# EAGLE design msp432_breakout_uart (EAGLE 7.5.0)
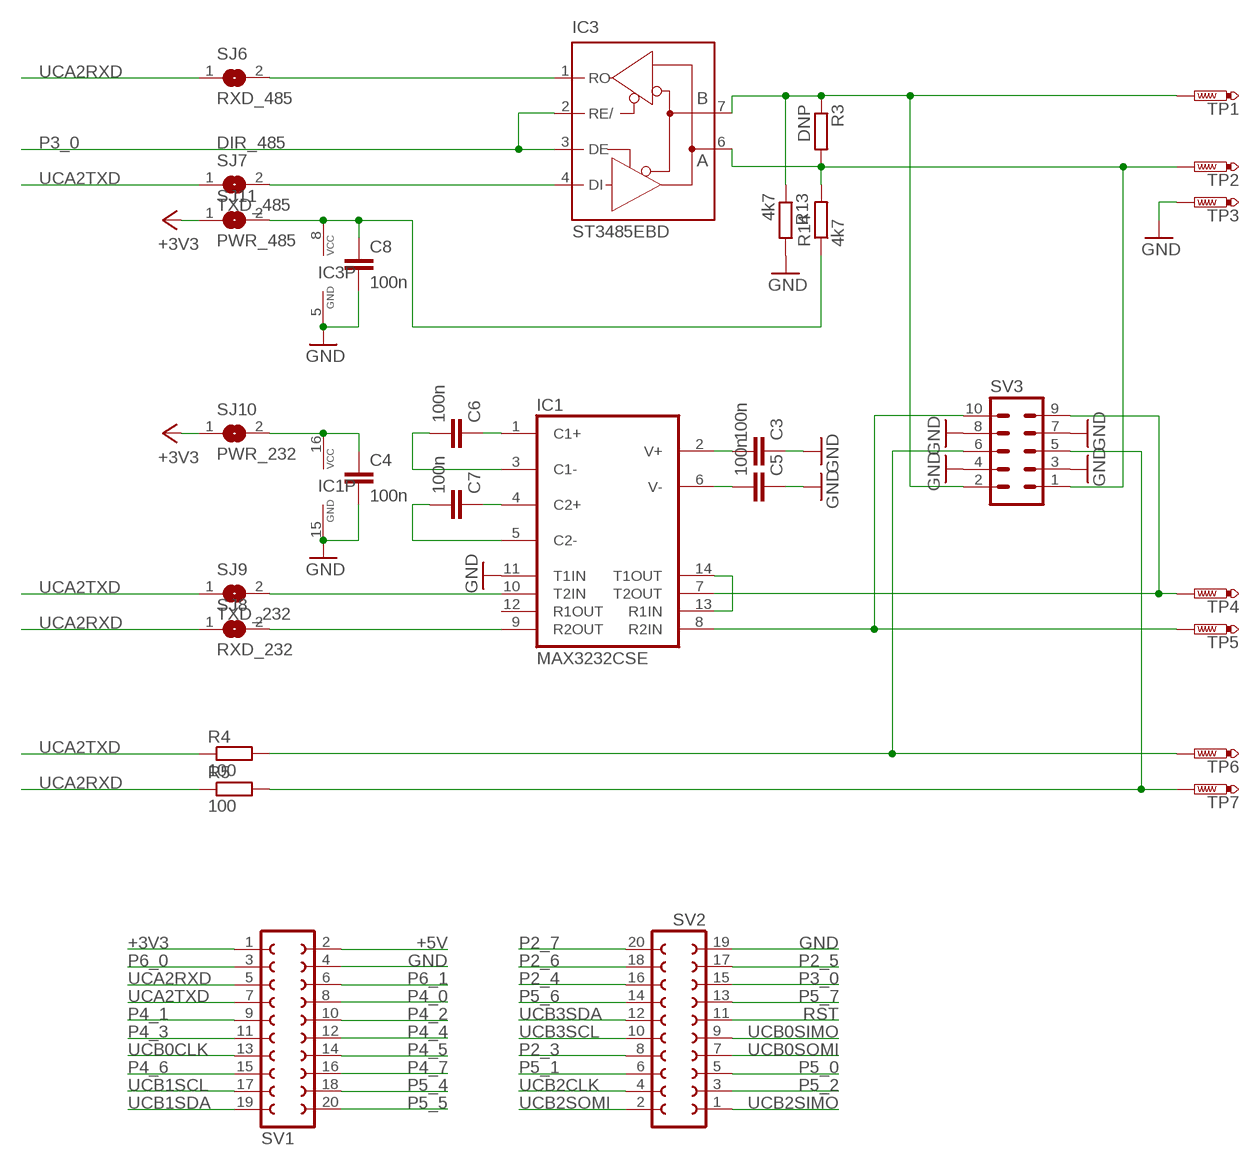
[diagram p0: schematic, sheet 1]

## Parts
C3  100n  C-EUC0603  [C0603]
C4  100n  C-EUC0603  [C0603]
C5  100n  C-EUC0603  [C0603]
C6  100n  C-EUC0603  [C0603]
C7  100n  C-EUC0603  [C0603]
C8  100n  C-EUC0603  [C0603]
IC1  MAX3232CSE  [SO16]
IC3  ST3485EBD  MAX481CSA  [SO08]
R3  DNP  R-EU_R0603  [R0603]
R4  100  R-EU_R0603  [R0603]
R5  100  R-EU_R0603  [R0603]
R13  4k7  R-EU_R0603  [R0603]
R14  4k7  R-EU_R0603  [R0603]
SJ6  RXD_485  SJ  [SJ]
SJ7  TXD_485  SJ  [SJ]
SJ8  RXD_232  SJ  [SJ]
SJ9  TXD_232  SJ  [SJ]
SJ10  PWR_232  SJ  [SJ]
SJ11  PWR_485  SJ  [SJ]
SV1  FE10-2  [FE10-2]
SV2  FE10-2  [FE10-2]
SV3  ML10  [ML10]
TP1  PTR1PAD1-20  [P1-20]
TP2  PTR1PAD1-20  [P1-20]
TP3  PTR1PAD1-20  [P1-20]
TP4  PTR1PAD1-20  [P1-20]
TP5  PTR1PAD1-20  [P1-20]
TP6  PTR1PAD1-20  [P1-20]
TP7  PTR1PAD1-20  [P1-20]

## Nets
+3V3: SJ10.1 SJ11.1 SV1.1
+5V: SV1.2
CA: IC3.6(A) R3.2 R14.2 SV3.1 TP2.TP
CB: IC3.7(B) R3.1 R13.1 SV3.2 TP1.TP
GND [power]: C3.1 C4.2 C5.1 C8.2 IC1.11(T1IN) IC1.15(GND) IC3.5(GND) R13.2 SV1.4 SV2.19 SV3.3 SV3.4 SV3.7 SV3.8 TP3.TP
N$1: IC1.8(R2IN) SV3.10 TP5.TP
N$2: R5.2 SV3.5 TP7.TP
N$4: R4.2 SV3.6 TP6.TP
N$6: IC1.7(T2OUT) SV3.9 TP4.TP
N$8: C5.2 IC1.6(V-)
N$9: C3.2 IC1.2(V+)
N$10: C6.1 IC1.1(C1+)
N$11: C6.2 IC1.3(C1-)
N$12: C7.1 IC1.4(C2+)
N$13: C7.2 IC1.5(C2-)
N$14: IC1.13(R1IN) IC1.14(T1OUT)
N$15: IC1.10(T2IN) SJ9.2
N$16: IC1.9(R2OUT) SJ8.2
N$17: IC3.1(RO) SJ6.2
N$18: IC3.4(DI) SJ7.2
N$19: C4.1 IC1.16(VCC) SJ10.2
N$20: C8.1 IC3.8(VCC) R14.1 SJ11.2
P2_3: SV2.8
P2_4: SV2.16
P2_5: SV2.17
P2_6: SV2.18
P2_7: SV2.20
P3_0: IC3.2(RE/) IC3.3(DE) SV2.15
P4_0: SV1.8
P4_1: SV1.9
P4_2: SV1.10
P4_3: SV1.11
P4_4: SV1.12
P4_5: SV1.14
P4_6: SV1.15
P4_7: SV1.16
P5_0: SV2.5
P5_1: SV2.6
P5_2: SV2.3
P5_4: SV1.18
P5_5: SV1.20
P5_6: SV2.14
P5_7: SV2.13
P6_0: SV1.3
P6_1: SV1.6
RST: SV2.11
UCA2RXD: R5.1 SJ6.1 SJ8.1 SV1.5
UCA2TXD: R4.1 SJ7.1 SJ9.1 SV1.7
UCB0CLK: SV1.13
UCB0SIMO: SV2.9
UCB0SOMI: SV2.7
UCB1SCL: SV1.17
UCB1SDA: SV1.19
UCB2CLK: SV2.4
UCB2SIMO: SV2.1
UCB2SOMI: SV2.2
UCB3SCL: SV2.10
UCB3SDA: SV2.12
Unconnected: IC1.12(R1OUT)

## Notes on the sheet
- DIR_485

## Library data of the parts
C3-C8 = rcl:C-EU: CAPACITOR, European symbol
IC1 = maxim:MAX3232*: True RS-232 Transceivers 3.0V to 5.5V, Low-Power up to 1Mbps, Using Four 0.1µF External Capacitors Source: http://pdfserv.maxim-ic.com/en/ds/MAX3222-MAX3241.pdf; MPN: MAX3232CSE; OC_FARNELL: 9725490; OC_NEWARK: 90C2890
IC3 = maxim:MAX481CSA: RS485 TRANSEIVER; MF: MAXIM; MPN: MAX481CSA; OC_FARNELL: unknown; OC_NEWARK: 90C3817
R3-R5 R13 R14 = rcl:R-EU_: RESISTOR, European symbol
SJ6-SJ11 = jumper:SJ: SMD solder JUMPER
SV1 SV2 = con-lsta:FE10-2: FEMALE HEADER; OC_FARNELL: unknown; OC_NEWARK: unknown
SV3 = con-harting-ml:ML10: HARTING; OC_FARNELL: unknown; OC_NEWARK: unknown
TP1-TP7 = testpad:PTR1: TEST PIN

## Net classes
1 power: width 0.254 mm, drill 0.33 mm, clearance 0.152 mm

## Board
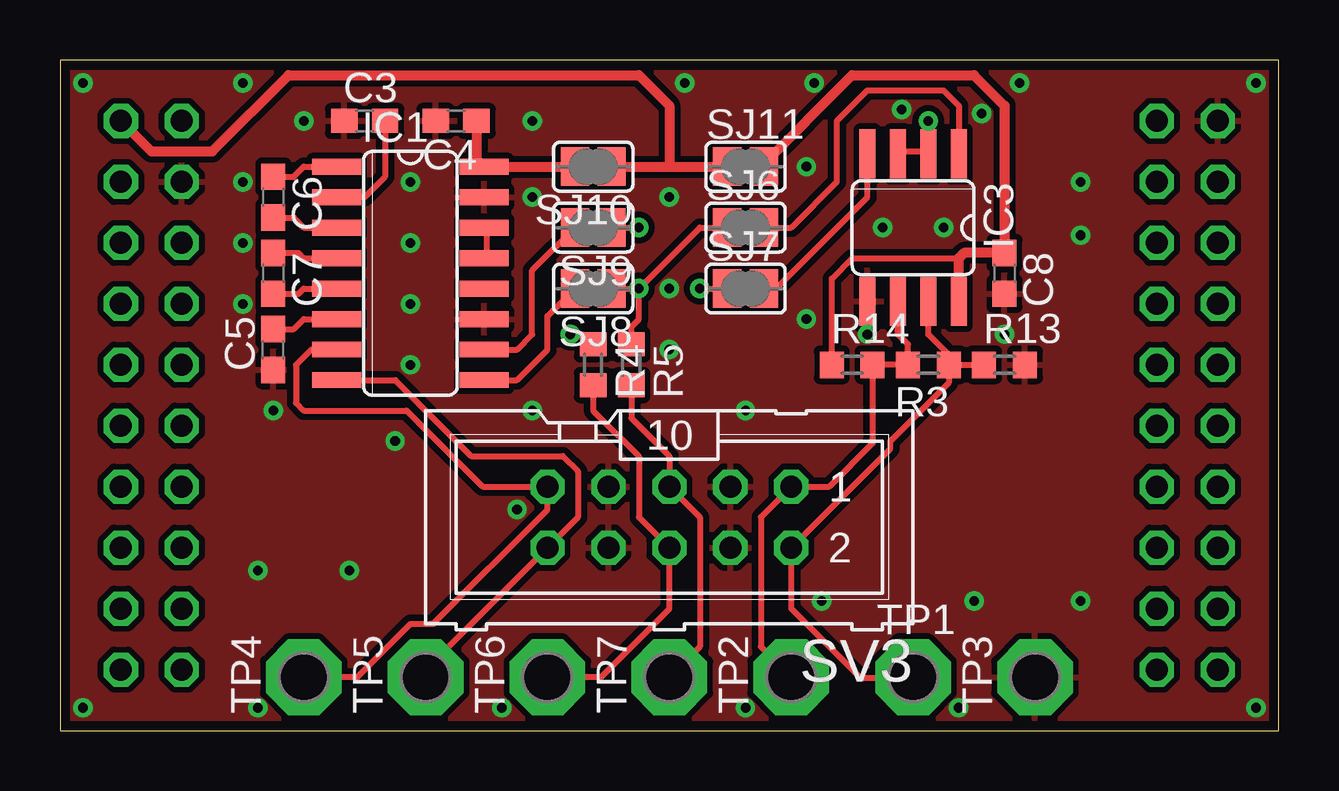
[diagram p1: board, top side]
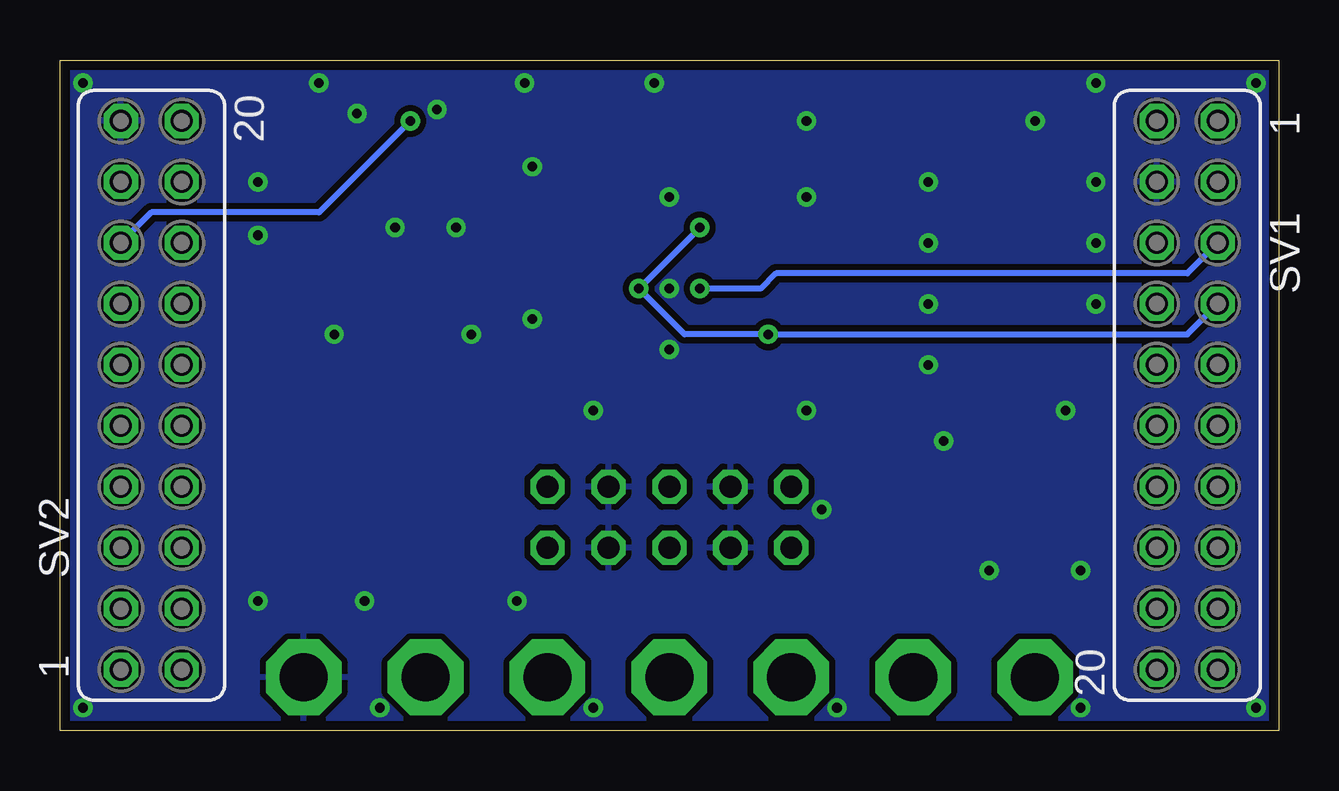
[diagram p2: board, bottom side, seen from below]

Size 50.8 x 27.94 mm. Coordinates in mm from the lower left corner, seen from the top.
Outline: 0,27.94 0,0 50.8,0 50.8,27.94 0,27.94
Copper layers (1*16): Top 0.035mm / dielectric 1.5mm / Bottom 0.035mm
Design rules "moje *": minimum track width 10mil, minimum drill 0.4mm, track to track 8mil, track to pad 8mil, pad to pad 8mil, via to via 8mil, smd to smd 0mil, copper to edge 16mil, drill to drill 8mil, minimum pad ring 10mil, minimum via ring 8mil, stop-mask expansion 4mil, vias tented up to drill 0.4mm, thermal gap 10mil

### Footprints (pad centres in the part's own frame; a part is rotated, then mirrored left to right if it is on the bottom)
C0603 = smd 1.1 x 1: 1 -0.85,0; 2 0.85,0
SO16 = smd 0.66 x 2.032: 1 -4.445,-3.073; 2 -3.175,-3.073; 3 -1.905,-3.073; 4 -0.635,-3.073; 5 0.635,-3.073; 6 1.905,-3.073; 7 3.175,-3.073; 8 4.445,-3.073; 9 4.445,3.073; 10 3.175,3.073; 11 1.905,3.073; 12 0.635,3.073; 13 -0.635,3.073; 14 -1.905,3.073; 15 -3.175,3.073; 16 -4.445,3.073
SO08 = smd 0.66 x 2.032: 1 -1.905,-3.073; 2 -0.635,-3.073; 3 0.635,-3.073; 4 1.905,-3.073; 5 1.905,3.073; 6 0.635,3.073; 7 -0.635,3.073; 8 -1.905,3.073
R0603 = smd 1 x 1.1: 1 -0.85,0; 2 0.85,0
SJ = smd 1.168 x 1.6: 1 -0.762,0; 2 0.762,0
FE10-2 = drill 0.914 octagon: 1 -11.43,1.27; 2 -11.43,-1.27; 3 -8.89,1.27; 4 -8.89,-1.27; 5 -6.35,1.27; 6 -6.35,-1.27; 7 -3.81,1.27; 8 -3.81,-1.27; 9 -1.27,1.27; 10 -1.27,-1.27; 11 1.27,1.27; 12 1.27,-1.27; 13 3.81,1.27; 14 3.81,-1.27; 15 6.35,1.27; 16 6.35,-1.27; 17 8.89,1.27; 18 8.89,-1.27; 19 11.43,1.27; 20 11.43,-1.27
ML10 = drill 0.914 octagon: 1 -5.08,-1.27; 2 -5.08,1.27; 3 -2.54,-1.27; 4 -2.54,1.27; 5 0,-1.27; 6 0,1.27; 7 2.54,-1.27; 8 2.54,1.27; 9 5.08,-1.27; 10 5.08,1.27
P1-20 = drill 2.007 pad 3.15 octagon: TP 0,0

### Placement (x,y rotation side)
C3  12.7,25.4 0 top
C4  16.51,25.4 180 top
C5  8.89,15.88 90 top
C6  8.89,22.23 270 top
C7  8.89,19.05 270 top
C8  39.37,19.05 270 top
IC1  14.61,19.05 270 top
IC3  35.56,20.95 180 top
R3  36.2,15.24 180 top
R4  22.23,15.24 270 top
R5  23.81,15.24 270 top
R13  39.37,15.24 0 top
R14  33.02,15.24 0 top
SJ6  28.57,20.95 0 top
SJ7  28.57,18.41 0 top
SJ8  22.23,18.41 180 top
SJ9  22.23,20.95 180 top
SJ10  22.23,23.5 180 top
SJ11  28.57,23.5 0 top
SV1  3.81,13.97 270 bottom
SV2  46.99,13.97 90 bottom
SV3  25.4,8.89 180 top
TP1  35.56,2.22 0 top
TP2  30.48,2.22 90 top
TP3  40.64,2.22 90 top
TP4  10.16,2.22 90 top
TP5  15.24,2.22 90 top
TP6  20.32,2.22 90 top
TP7  25.4,2.22 90 top

### Tracks (layer width: path | path; a pad name or v marks a point on that pad's centre or on a via)
+3V3
  Top 0.406: SJ10.1 25.4,23.5 | 25.4,23.5 SJ11.1 | SV1.1 3.81,24.13 6.35,24.13 9.53,27.3 24.13,27.3 25.4,26.04 25.4,23.5
CA
  Top 0.254: IC3.6 34.92,16.51 35.34,16.09 R3.2 R14.2 33.87,11.96 32.07,10.16 SV3.1 29.21,8.89 29.21,3.49 TP2.TP
CB
  Top 0.254: R3.1 37.05,15.66 36.2,16.51 IC3.7 | R3.1 R13.1 | R3.1 37.05,14.5 34.61,12.06 34.61,11.75 SV3.2 30.48,5.08 33.36,2.2 35.54,2.2 TP1.TP
GND  (via drill 0.4)
  other vias: 33.66,16.51 39.37,16.51 34.29,20.95 36.83,20.95 8.26,6.67 12.06,6.67 31.75,5.4 38.1,5.4 42.55,5.4 0.95,26.99 49.85,26.99 49.85,0.95 0.95,0.95 14.61,22.86 14.61,17.78 10.16,25.4 19.68,25.4 19.68,22.23 19.68,13.34 13.97,12.06 8.89,13.34 7.62,22.86 7.62,17.78 26.04,26.99 40.01,26.99 31.11,23.5 31.11,17.14 25.4,22.23 25.4,18.41 25.4,15.88 28.57,13.34 42.55,22.86 28.57,0.95 18.41,0.95 8.26,0.95 37.47,0.95 14.61,20.32 7.62,20.32 42.55,20.64 7.62,26.99 19.05,9.21 35.08,25.88 38.42,25.72 31.43,26.99 14.61,15.24
  pour Top (isolate 0.254): 0,0 50.8,0 50.8,27.94 0,27.94
  pour Bottom (isolate 0.254): 0,0 50.8,0 50.8,27.94 0,27.94
N$1
  Top 0.254: IC1.8 13.97,14.61 17.14,11.43 20.95,11.43 21.59,10.79 21.59,8.89 SV3.10 15.24,2.54 TP5.TP
N$2
  Top 0.254: R5.2 23.81,13.02 25.4,11.43 SV3.5 26.67,8.89 26.67,3.49 TP7.TP
N$4
  Top 0.254: R4.2 22.23,13.34 24.13,11.43 24.13,8.89 SV3.6 25.4,5.08 22.54,2.22 TP6.TP
N$6
  Top 0.254: IC1.7 10.48,15.88 9.84,15.24 9.84,13.65 10.16,13.34 14.45,13.34 17.62,10.16 SV3.9 20.32,9.21 15.56,4.45 14.61,4.45 12.38,2.22 TP4.TP
N$8
  Top 0.254: C5.2 9.74,16.73 10.16,17.14 IC1.6
N$9
  Top 0.254: C3.2 13.55,23.07 12.7,22.23 IC1.2
N$10
  Top 0.254: C6.1 9.74,23.07 10.16,23.5 IC1.1
N$11
  Top 0.254: C6.2 9.74,21.38 10.16,20.95 IC1.3
N$12
  Top 0.254: C7.1 9.95,19.9 10.16,19.68 IC1.4
N$13
  Top 0.254: C7.2 9.95,18.2 10.16,18.41 IC1.5
N$14
  Top 0.254: IC1.14 17.78,20.95 17.78,19.79 IC1.13
N$15
  Top 0.254: IC1.10 19.05,15.88 19.68,16.51 19.68,19.18 SJ9.2
N$16
  Top 0.254: IC1.9 19.05,14.61 20.32,15.88 20.32,17.27 SJ8.2
N$17
  Top 0.254: SJ6.2 30.48,20.95 32.38,22.86 32.38,25.4 33.66,26.67 36.83,26.67 37.47,26.04 IC3.1
N$18
  Top 0.254: SJ7.2 29.84,18.41 33.66,22.23 IC3.4
N$19
  Top 0.406: SJ10.2 IC1.16 17.36,23.81 C4.1
N$20
  Top 0.254: R14.1 32.17,18.84 33.02,19.68 37.47,19.68
  Top 0.406: SJ11.2 29.21,23.5 33.02,27.3 38.1,27.3 39.37,26.04 C8.1 37.68,19.9 37.47,19.68 IC3.8
P3_0  (via drill 0.4)
  Top 0.254: IC3.3 34.92,24.13 36.09,24.13 | 36.09,24.13 36.2,24.13 v36.2,25.4 | 36.09,24.13 IC3.2
  Bottom 0.254: SV2.15 46.99,21.59 40.01,21.59 v36.2,25.4
UCA2RXD  (via drill 0.4)
  Top 0.254: SJ8.1 v24.13,18.41 | v24.13,18.41 26.67,20.95 SJ6.1 | R5.1 23.81,16.83 24.13,17.14 v24.13,18.41
  Bottom 0.254: SV1.5 3.81,19.05 20.95,19.05 21.59,18.41 v24.13,18.41
UCA2TXD  (via drill 0.4)
  Top 0.254: v26.67,18.41 SJ7.1 | SJ9.1 v24.13,20.95 | v21.27,16.51 21.8,16.51 R4.1
  Bottom 0.254: SV1.7 3.81,16.51 v21.27,16.51 24.77,16.51 v26.67,18.41 v24.13,20.95

### Text on the board
potisk: 232 | 485 | v1/ | 2016 | DREL | UART breakout | for | MSP432 | A | B | TXD | RXD | TX | RX | GND